# EAGLE design OwlPedal2 (EAGLE 9.6.2)
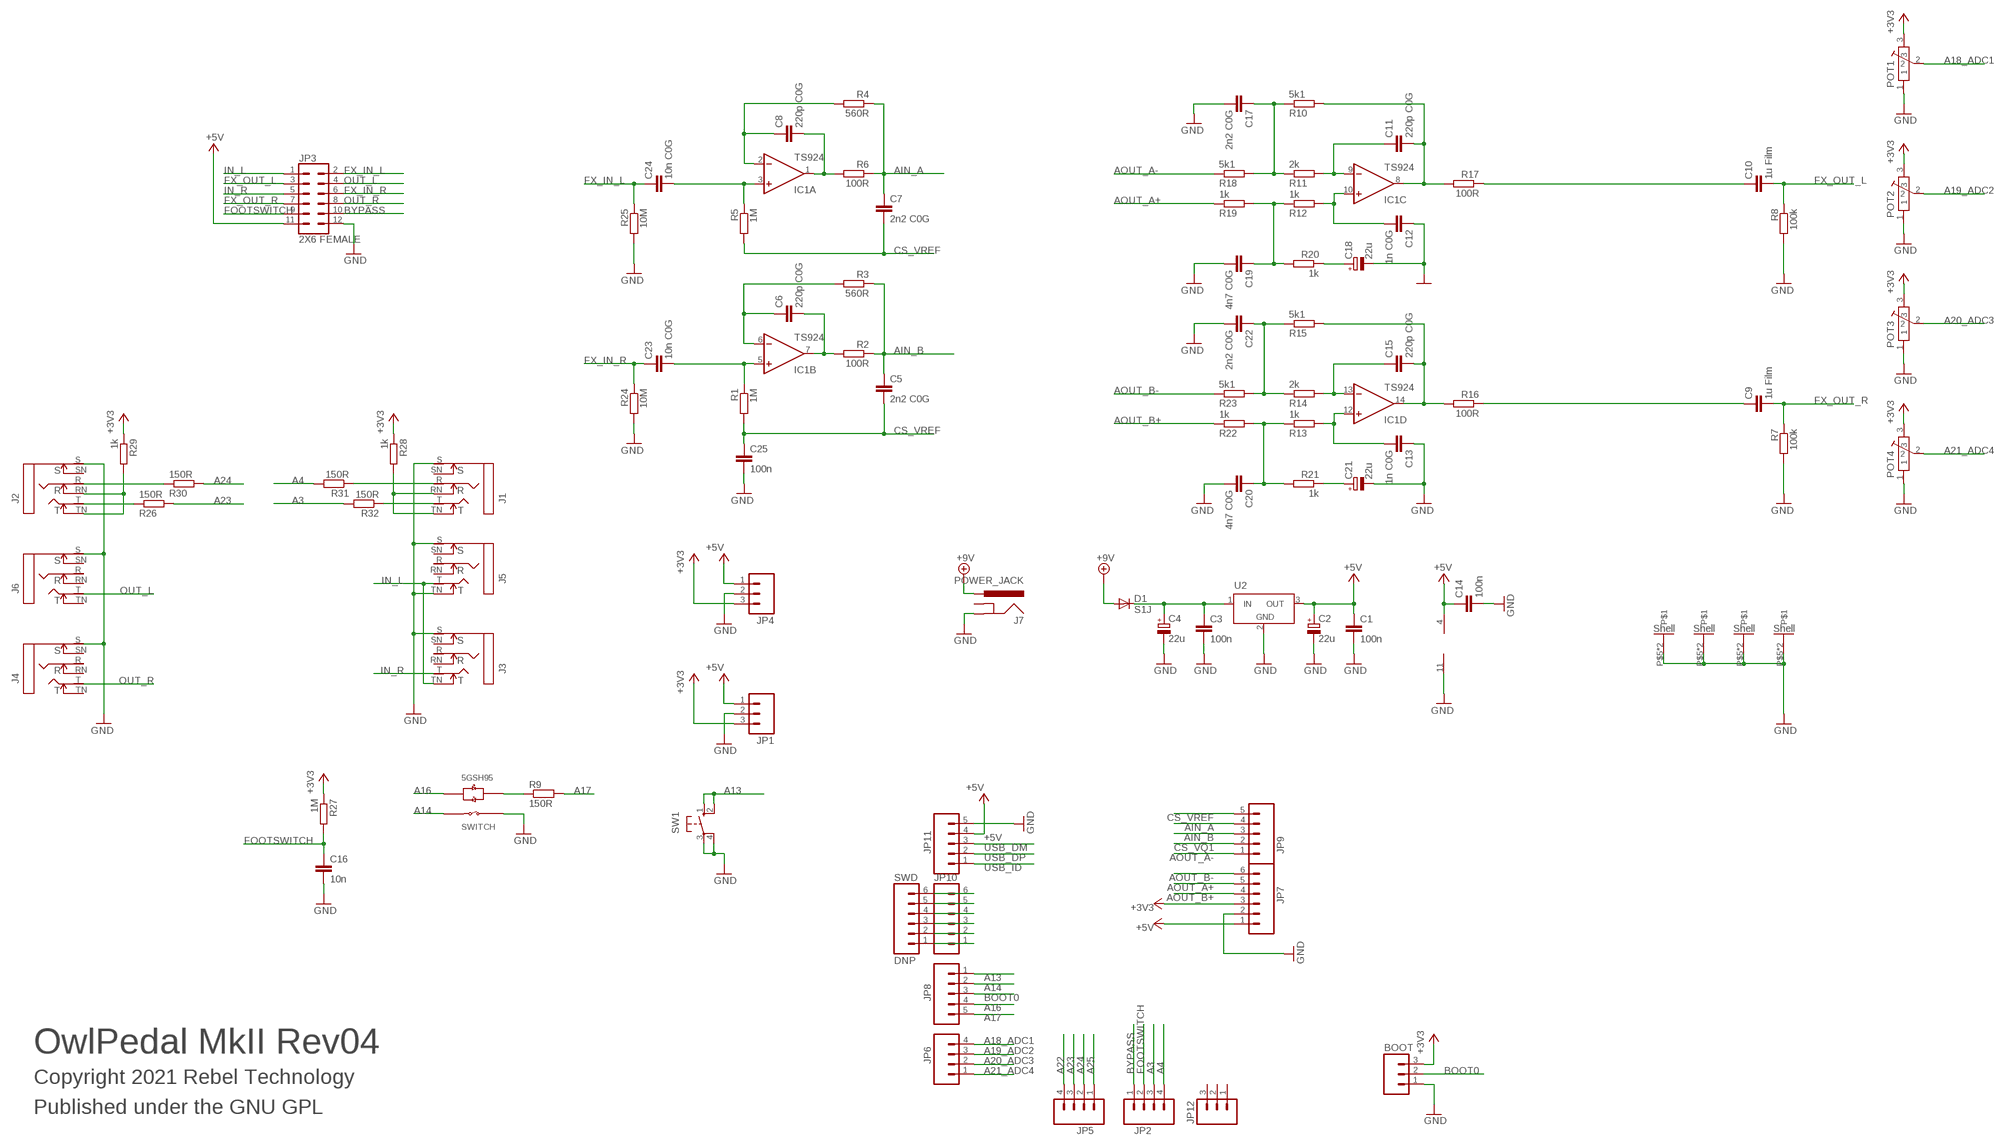
[diagram p0: schematic, sheet 1]

## Parts
BOOT  M03PTH  [1X03]
C1  100n  C-EUC0603  [C0603]
C2  22u  CPOL-EU153CLV-0505  [CPOL-5]
C3  100n  C-EUC0603  [C0603]
C4  22u  CPOL-EU153CLV-0505  [CPOL-5]
C5  2n2 C0G  C-EUC0603  [C0603]
C6  220p C0G  C-EUC0603  [C0603]
C7  2n2 C0G  C-EUC0603  [C0603]
C8  220p C0G  C-EUC0603  [C0603]
C9  1u Film  C-EUC1210  [C1210]
C10  1u Film  C-EUC1210  [C1210]
C11  220p C0G  C-EUC0603  [C0603]
C12  1n C0G  C-EUC0603  [C0603]
C13  1n C0G  C-EUC0603  [C0603]
C14  100n  C-EUC0603  [C0603]
C15  220p C0G  C-EUC0603  [C0603]
C16  10n  C-EUC0603  [C0603]
C17  2n2 C0G  C-EUC0603  [C0603]
C18  22u  CPOL-EU153CLV-0505  [CPOL-5]
C19  4n7 C0G  C-EUC0603  [C0603]
C20  4n7 C0G  C-EUC0603  [C0603]
C21  22u  CPOL-EU153CLV-0505  [CPOL-5]
C22  2n2 C0G  C-EUC0603  [C0603]
C23  10n C0G  C-EUC0603  [C0603]
C24  10n C0G  C-EUC0603  [C0603]
C25  100n  C-EUC0603  [C0603]
D1  S1J  DIODESMA  [SMA-DIODE]
IC1  TS924  LM324D  [SO14]
J1  NEUTRIK_NMJ6HCD2  [NMJ6HCD2]
J2  NEUTRIK_NMJ6HCD2  [NMJ6HCD2]
J3  NEUTRIK_NMJ6HCD2  [NMJ6HCD2]
J4  NEUTRIK_NMJ6HCD2  [NMJ6HCD2]
J5  NEUTRIK_NMJ6HCD2  [NMJ6HCD2]
J6  NEUTRIK_NMJ6HCD2  [NMJ6HCD2]
J7  POWER_JACK  [DC_JACK_SLOT]
JP1  M03PTH  [1X03]
JP2  M04PTH  [1X04]
JP3  2X6 FEMALE  CONN_06X2PTH_FEMALE  [2X6]
JP4  M03PTH  [1X03]
JP5  M04PTH  [1X04]
JP6  M04PTH  [1X04]
JP7  M06SIP  [1X06]
JP8  M05PTH  [1X05]
JP9  M05PTH  [1X05]
JP10  M06SIP  [1X06]
JP11  M05PTH  [1X05]
JP12  M03PTH  [1X03]
POT1  POT-ALPS-RK09L1140  [POT-ALPS-RK09L1140]
POT2  POT-ALPS-RK09L1140  [POT-ALPS-RK09L1140]
POT3  POT-ALPS-RK09L1140  [POT-ALPS-RK09L1140]
POT4  POT-ALPS-RK09L1140  [POT-ALPS-RK09L1140]
R1  1M  R-EU_0603  [0603]
R2  100R  R-EU_0603  [0603]
R3  560R  R-EU_0603  [0603]
R4  560R  R-EU_0603  [0603]
R5  1M  R-EU_0603  [0603]
R6  100R  R-EU_0603  [0603]
R7  100k  R-EU_0603  [0603]
R8  100k  R-EU_0603  [0603]
R9  150R  R-EU_0603  [0603]
R10  5k1  R-EU_0603  [0603]
R11  2k  R-EU_0603  [0603]
R12  1k  R-EU_0603  [0603]
R13  1k  R-EU_0603  [0603]
R14  2k  R-EU_0603  [0603]
R15  5k1  R-EU_0603  [0603]
R16  100R  R-EU_0603  [0603]
R17  100R  R-EU_0603  [0603]
R18  5k1  R-EU_0603  [0603]
R19  1k  R-EU_0603  [0603]
R20  1k  R-EU_0603  [0603]
R21  1k  R-EU_0603  [0603]
R22  1k  R-EU_0603  [0603]
R23  5k1  R-EU_0603  [0603]
R24  10M  R-EU_0603  [0603]
R25  10M  R-EU_0603  [0603]
R26  150R  R-EU_0603  [0603]
R27  1M  R-EU_0603  [0603]
R28  1k  R-EU_0603  [0603]
R29  1k  R-EU_0603  [0603]
R30  150R  R-EU_0603  [0603]
R31  150R  R-EU_0603  [0603]
R32  150R  R-EU_0603  [0603]
SW1  10-XX  [B3F-10XX]
SW2  5GTH9  [5GTH9]
SWD  DNP  M06SIP  [1X06]
U2  TSR-1-2450  [TSR-1-2450]

## Nets
+3V3: BOOT.3 JP1.3 JP4.3 JP7.3 POT1.3 POT2.3 POT3.3 POT4.3 R27.1 R28.1 R29.1
+5V: C1.1 C2.+ C14.1 IC1.4(P:V+) JP1.1 JP3.11 JP4.1 JP7.1 JP11.4 U2.3(OUT)
+9V: D1.A J7.PWR
A3: JP2.3 R32.2
A4: JP2.4 R31.2
A13: JP8.1 SW1.1(S) SW1.2(S1)
A14: JP8.2 SW2.4(SWITCH_A)
A16: JP8.4 SW2.-2(LED_G+)
A17: JP8.5 R9.2
A18_ADC1: JP6.4 POT1.2
A19_ADC2: JP6.3 POT2.2
A20_ADC3: JP6.2 POT3.2
A21_ADC4: JP6.1 POT4.2
A22: JP5.4
A23: JP5.3 R26.2
A24: JP5.2 R30.2
A25: JP5.1
AIN_A: C7.1 JP9.4 R4.1 R6.1
AIN_B: C5.1 JP9.3 R2.1 R3.1
AOUT_A+: JP7.5 R19.1
AOUT_A-: JP9.1 R18.1
AOUT_B+: JP7.4 R22.1
AOUT_B-: JP7.6 R23.1
BOOT0: BOOT.2 JP8.3
BYPASS: JP2.1 JP3.10
CS_VQ1: JP9.2
CS_VREF: C5.2 C7.2 C25.1 JP9.5 R1.2 R5.2
DC_IN_L: C24.1 IC1.3(A:+IN) R5.1
DC_IN_R: C23.1 IC1.5(B:+IN) R1.1
FOOTSWITCH: C16.1 JP2.2 JP3.9 R27.2
FX_IN_L: C24.2 JP3.2 R25.1
FX_IN_R: C23.2 JP3.6 R24.1
FX_OUT_L: C10.2 JP3.3 R8.1
FX_OUT_R: C9.2 JP3.7 R7.1
GND: BOOT.1 C1.2 C2.- C3.2 C4.- C12.1 C13.1 C14.2 C16.2 C17.2 C18.- C19.2 C20.2 C21.- C22.2 C25.2 IC1.11(P:V-) J1.S J2.S J3.S J4.S J5.S J5.TN J6.S J7.GND JP1.2 JP3.12 JP4.2 JP7.2 JP11.5 POT1.1 POT1.P$5 POT1.P$6 POT2.1 POT2.P$5 POT2.P$6 POT3.1 POT3.P$5 POT3.P$6 POT4.1 POT4.P$5 POT4.P$6 R7.2 R8.2 R24.2 R25.2 SW1.3(P) SW1.4(P1) SW2.1(SWITCH_B) U2.2(GND)
IN_L: J3.TN J5.T JP3.1
IN_R: J3.T JP3.5
N$1: J1.RN J1.TN R28.2
N$2: J2.R R30.1
N$3: JP10.1 SWD.1
N$4: J2.RN J2.TN R29.2
N$5: JP10.2 SWD.2
N$6: JP10.3 SWD.3
N$7: JP10.4 SWD.4
N$8: JP10.5 SWD.5
N$9: JP10.6 SWD.6
N$10: R9.1 SW2.+3(LED_R+)
N$12: J1.R R31.1
N$13: C17.1 R10.1 R11.1 R18.2
N$14: C6.1 IC1.6(B:-IN) R3.2
N$15: J1.T R32.1
N$16: C11.1 IC1.9(C:-IN) R11.2
N$17: C12.2 IC1.10(C:+IN) R12.2
N$18: C19.1 R12.1 R19.2 R20.2
N$19: C15.1 IC1.13(D:-IN) R14.2
N$20: C13.2 IC1.12(D:+IN) R13.2
N$21: C20.1 R13.1 R21.2 R22.2
N$22: C8.1 IC1.2(A:-IN) R4.2
N$23: C8.2 IC1.1(A:OUT) R6.2
N$24: C22.1 R14.1 R15.1 R23.2
N$25: C6.2 IC1.7(B:OUT) R2.2
N$26: J2.T R26.1
N$28: C11.2 IC1.8(C:OUT) R10.2 R17.2
N$29: C18.+ R20.1
N$30: C9.1 R16.1
N$31: C21.+ R21.1
N$32: C15.2 IC1.14(D:OUT) R15.2 R16.2
N$35: C10.1 R17.1
N$51: C3.1 C4.+ D1.C U2.1(IN)
OUT_L: J6.T JP3.4
OUT_R: J4.T JP3.8
USB_DM: JP11.3
USB_DP: JP11.2
USB_ID: JP11.1
Unconnected: J1.SN J2.SN J3.R J3.RN J3.SN J4.R J4.RN J4.SN J4.TN J5.R J5.RN J5.SN J6.R J6.RN J6.SN J6.TN J7.GNDBREAK JP12.1 JP12.2 JP12.3

## Notes on the sheet
- OwlPedal MkII Rev04
- Copyright 2021 Rebel Technology
- Published under the GNU GPL

## Library data of the parts
BOOT JP1 JP4 JP12 = SparkFun:M03: Header 3 Standard 3-pin 0.1" header. Use with straight break away headers (SKU : PRT-00116), right angle break away headers (PRT-00553), swiss pins (PRT-00743), machine pins (PRT-00117), and female headers (PRT-00115). Molex polarized connector foot print use with SKU : PRT-08232 with associated crimp pins and housings.
C1 C3 C9 C10 C16 C23-C25 = Rebel:C-EU: CAPACITOR, European symbol
C2 C4 C18 C21 = Rebel:CPOL-EU: POLARIZED CAPACITOR, European symbol
C5-C8 C11-C15 C17 C19 C20 C22 = resistor:C-EU: CAPACITOR, European symbol
D1 = SparkFun:DIODE: Diode These are standard reverse protection diodes and small signal diodes. SMA package can handle up to about 1A. SOD-323 can handle about 200mA. What the SOD-323 package when ordering, there are some mfgs out there that are 5-pin packages.
IC1 = linear:LM324: OP AMP
J1-J6 = neutrik_jacks:NEUTRIK_NMJ6HCD2
J7 = Rebel:POWER_JACK: Power Jack This is the standard 5.5mm barrel jack for power. The PTH is the most common, proven, reliable, footprint. All others are experimental. The Slot footprint only works if the mill layer is transmitted to the PCB fab house so be warned. Spark Fun Electronics SKU : PRT-00119. Mating wall wart : TOL-00298 (and others)
JP2 JP5 JP6 = SparkFun:M04: Header 4 Standard 4-pin 0.1" header. Use with straight break away headers (SKU : PRT-00116), right angle break away headers (PRT-00553), swiss pins (PRT-00743), machine pins (PRT-00117), and female headers (PRT-00115). Molex polarized connector foot print use with SKU : PRT-08231 with associated crimp pins and housings. 1MM SMD Version SKU: PRT-10208
JP3 = SparkFun-Connectors:CONN_06X2: Multi connection point. Often used as Generic Header-pin footprint for 0.1 inch spaced/style header connections On any of the 0.1 inch spaced packages, you can populate with these: Break Away Headers - Straight <https://www.sparkfun.com/products/116> (PRT-00116) Break Away Male Headers - Right Angle <https://www.sparkfun.com/products/553> (PRT-00553) Female Headers <https://www.sparkfun.com/products/115> (PRT-00115) Break Away Headers - Machine Pin <https://www.sparkfun.com/products/117> (PRT-00117) Break Away Female Headers - Swiss Machine Pin <https://www.sparkfun.com/products/743> (PRT-00743); PROD_ID: CONN-12423
JP7 JP10 SWD = SparkFun:M06: Header 6 Standard 6-pin 0.1" header. Use with straight break away headers (SKU : PRT-00116), right angle break away headers (PRT-00553), swiss pins (PRT-00743), machine pins (PRT-00117), and female headers (PRT-00115). Molex polarized connector foot print use with SKU : PRT-08094 with associated crimp pins and housings. NOTES ON THE VARIANTS LOCK and LOCK_LONGPADS... This footprint was designed to help hold the alignment of a through-hole component (i.e. 6-pin header) while soldering it into place. You may notice that each hole has been shifted either up or down by 0.005 of an inch from it's more standard position (which is a perfectly straight line). This slight alteration caused the pins (the squares in the middle) to touch the edges of the holes. Because they are alternating, it causes a "brace" to hold the component in place. 0.005 has proven to be the perfect amount of "off-center" position when using our standard breakaway headers. Although looks a little odd when you look at the bare footprint, once you have a header in there, the alteration is very hard to notice. Also, if you push a header all the way into place, it is covered up entirely on the bottom side. This idea of altering the position of holes to aid alignment will be further integrated into the Sparkfun Library for other footprints. It can help hold any component with 3 or more connection pins.
JP8 JP9 JP11 = SparkFun:M05: Header 5 Standard 5-pin 0.1" header. Use with straight break away headers (SKU : PRT-00116), right angle break away headers (PRT-00553), swiss pins (PRT-00743), machine pins (PRT-00117), and female headers (PRT-00115). Molex polarized connector foot print use with SKU : PRT-08230 with associated crimp pins and housings.
POT1-POT4 = Rebel:POT-ALPS-RK09L
R1-R32 = Rebel:R-EU_: RESISTOR, European symbol
SW1 = switch-omron:10-XX: OMRON SWITCH; MPN: B3F-1000; OC_FARNELL: 176432; OC_NEWARK: 36M3542
SW2 = SWITCH-5GTH9:5GTH9
U2 = Hangar:TSR-1-2450

## Board
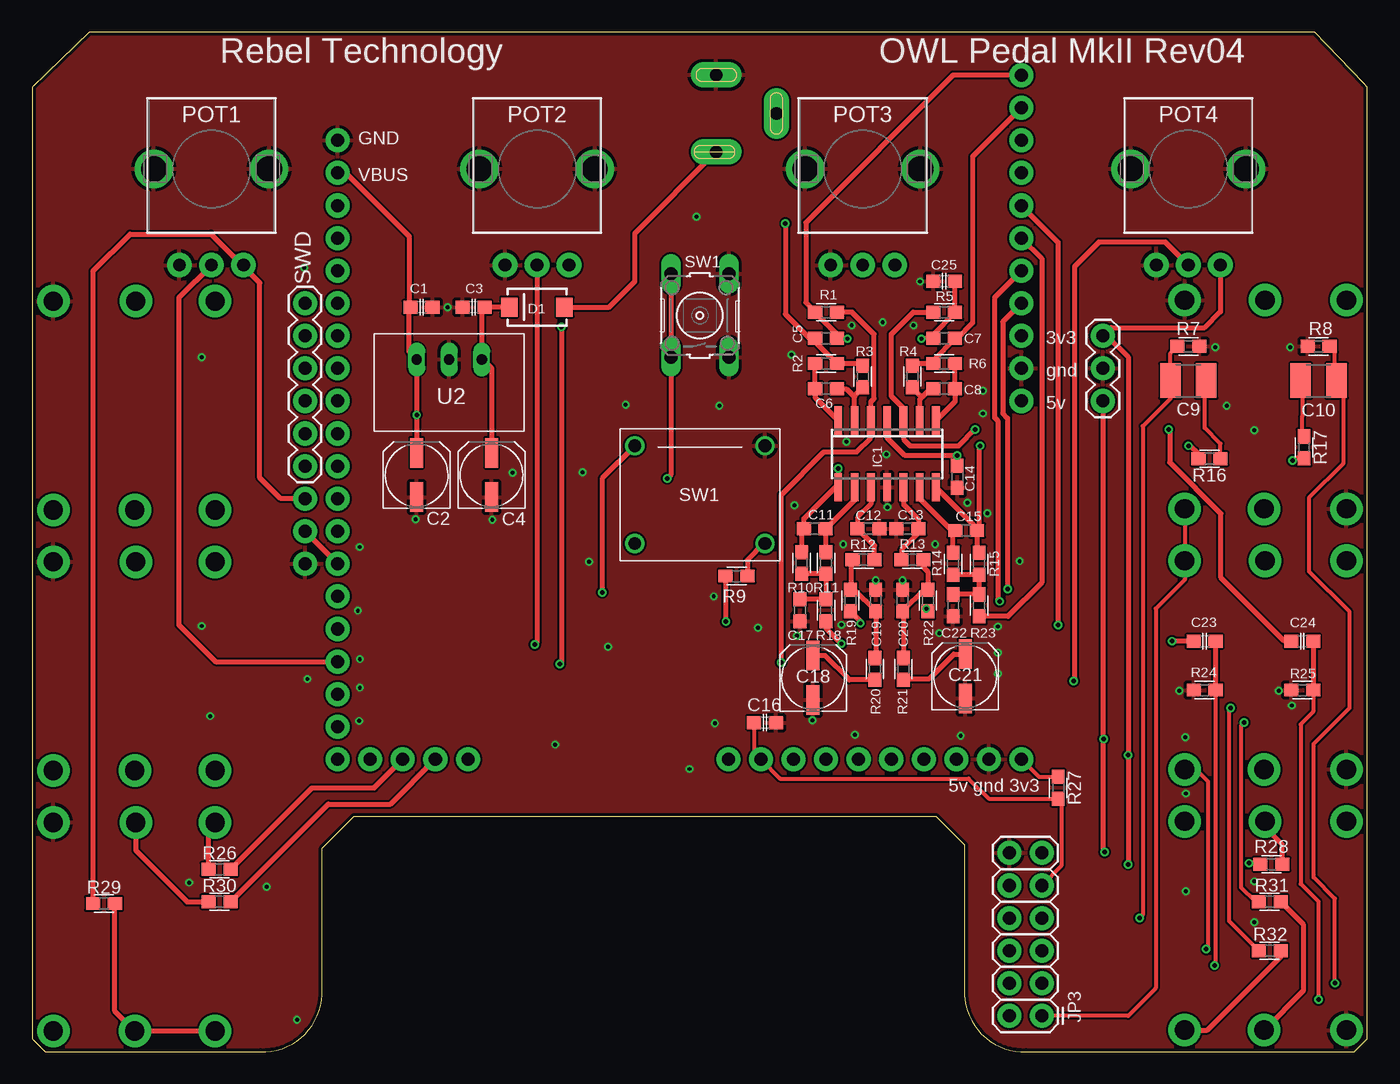
[diagram p1: board, top side]
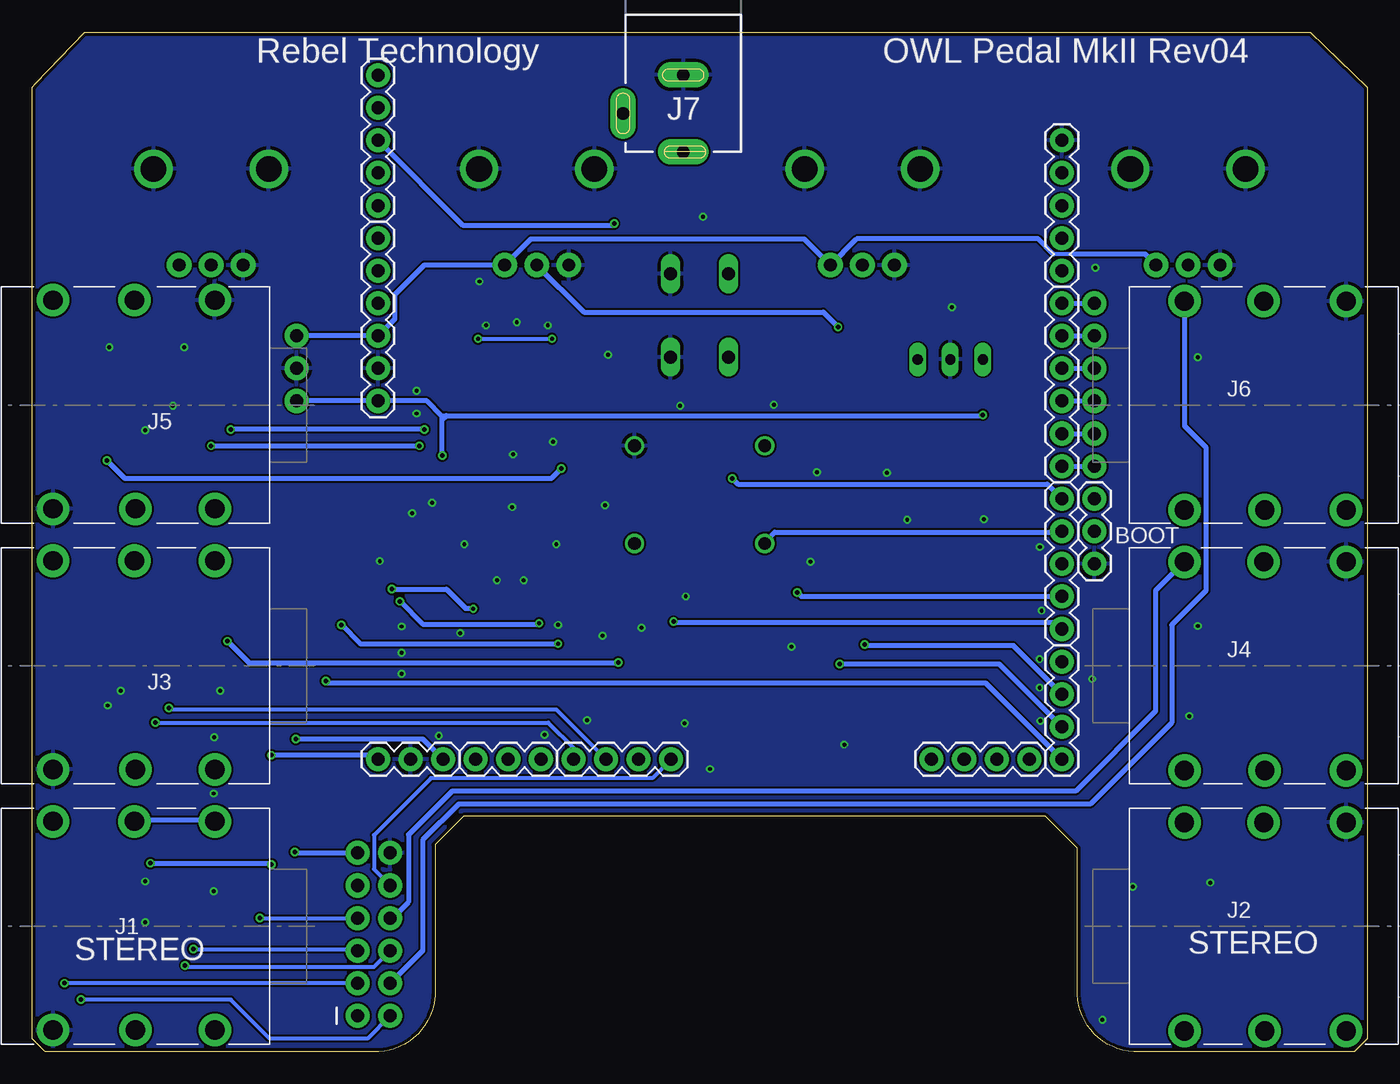
[diagram p2: board, bottom side, seen from below]

Size 104.17 x 79.5 mm. Coordinates in mm from the lower left corner, seen from the top.
Outline: 22.63,4.45 arc-90 17.81,0 1.04,0 0.03,1.02 0.03,75.18 0,75.18 4.45,79.5 100.06,79.5 103.87,75.5 104.17,75.18 104.17,1.02 103.15,0 77.56,0 arc-90 72.73,4.45 72.73,16.13 70.51,18.35 25.11,18.35 22.63,15.87 22.63,4.45
Outline: 22.63,4.41 22.63,4.45
Copper layers (1*16): Top 0.035mm / dielectric 1.5mm / Bottom 0.035mm
Design rules "SeeedStudio_2layer_DRU_no_angle_20140221": minimum track width 6mil, minimum drill 12mil, track to track 6mil, track to pad 6mil, pad to pad 6mil, via to via 6mil, smd to smd 0mil, copper to edge 10mil, drill to drill 10mil, minimum pad ring 10mil, minimum via ring 6mil, stop-mask expansion 2mil, vias tented up to drill 100mil, thermal gap 10mil

### Footprints (pad centres in the part's own frame; a part is rotated, then mirrored left to right if it is on the bottom)
1X03 = drill 1.016 pad 1.88: 1 0,0; 2 2.54,0; 3 5.08,0
C0603 = smd 1.1 x 1: 1 -0.85,0; 2 0.85,0
CPOL-5 = smd 2.3 x 1: + 1.725,0; - -1.725,0
C1210 = smd 1.6 x 2.7: 1 -1.4,0; 2 1.4,0
SMA-DIODE = smd 1.27 x 1.47: A -2.15,0; C 2.15,0
SO14 = smd 0.6 x 2.2: 1 -3.81,-2.6; 2 -2.54,-2.6; 3 -1.27,-2.6; 4 0,-2.6; 5 1.27,-2.6; 6 2.54,-2.6; 7 3.81,-2.6; 8 3.81,2.6; 9 2.54,2.6; 10 1.27,2.6; 11 0,2.6; 12 -1.27,2.6; 13 -2.54,2.6; 14 -3.81,2.6
NMJ6HCD2 = drill 1.5 pad 2.54: R -0.318,8.096; RN -0.238,-8.176; S 6.112,8.096; SN 6.112,-8.176; T -6.509,8.096; TN -6.509,-8.176
DC_JACK_SLOT = drill 1 pad 2 long: GND 0,4.743; GNDBREAK 4.697,7.742; PWR 0,10.749
1X04 = drill 1.016 pad 1.88: 1 0,0; 2 2.54,0; 3 5.08,0; 4 7.62,0
2X6 = drill 1.016 pad 1.88: 1 0,0; 2 0,2.54; 3 2.54,0; 4 2.54,2.54; 5 5.08,0; 6 5.08,2.54; 7 7.62,0; 8 7.62,2.54; 9 10.16,0; 10 10.16,2.54; 11 12.7,0; 12 12.7,2.54
1X06 = drill 1.016 pad 1.88: 1 0,0; 2 2.54,0; 3 5.08,0; 4 7.62,0; 5 10.16,0; 6 12.7,0
1X05 = drill 1.016 pad 1.88: 1 0,0; 2 2.54,0; 3 5.08,0; 4 7.62,0; 5 10.16,0
POT-ALPS-RK09L1140 = drill 1 pad 1.93: 1 -2.5,-7.5; 2 0,-7.5; 3 2.5,-7.5 | drill 2: P$5 -4.5,0; P$6 4.5,0
0603 = smd 1.1 x 1: 1 -0.85,0; 2 0.85,0
B3F-10XX = drill 1.016 long: 1 -3.251,2.261; 2 3.251,2.261; 3 -3.251,-2.261; 4 3.251,-2.261
5GTH9 = drill 1: 1 5.08,3.81; 4 -5.08,-3.81; +3 5.08,-3.81; -2 -5.08,3.81
TSR-1-2450 = drill 0.8 long: 1 -2.54,0; 2 0,0; 3 2.54,0

### Placement (x,y rotation side)
BOOT  21.3,38.04 90 bottom
C1  30.38,58.04 0 top
C2  30,44.96 90 top
C3  34.44,58.04 180 top
C4  35.84,44.96 90 top
C5  61.94,55.63 0 top
C6  61.94,51.69 180 top
C7  71.15,55.63 180 top
C8  71.15,51.69 0 top
C9  90.2,52.32 180 top
C10  100.36,52.32 0 top
C11  61.05,40.77 180 top
C12  65.24,40.77 180 top
C13  68.29,40.77 0 top
C14  72.16,44.83 270 top
C15  72.86,40.64 0 top
C16  57.18,25.65 0 top
C17  59.91,34.42 270 top
C18  60.92,29.15 90 top
C19  65.81,35.18 90 top
C20  67.91,35.18 90 top
C21  72.8,29.27 90 top
C22  71.84,34.8 270 top
C23  91.47,32 0 top
C24  99.09,32 0 top
C25  71.15,60.07 180 top
D1  39.38,58.05 180 top
IC1  66.7,46.61 180 top
J1  96.42,9.78 180 bottom
J2  7.77,9.78 0 bottom
J3  96.42,30.1 180 bottom
J4  7.77,30.1 0 bottom
J5  96.42,50.42 180 bottom
J6  7.77,50.42 0 bottom
J7  53.37,80.9 180 bottom
JP1  83.53,50.74 90 top
JP2  54.32,22.8 180 bottom
JP3  78.77,2.79 90 top
JP4  72.1,22.8 180 bottom
JP5  34,22.8 0 bottom
JP6  23.84,22.8 90 bottom
JP7  77.18,50.74 90 bottom
JP8  23.84,43.12 270 bottom
JP9  77.18,65.98 90 bottom
JP10  23.84,58.36 270 bottom
JP11  23.84,60.9 90 bottom
JP12  64.48,22.8 180 bottom
POT1  14,68.83 0 top
POT2  39.4,68.83 0 top
POT3  64.8,68.83 0 top
POT4  90.2,68.83 0 top
R1  61.94,57.66 180 top
R2  61.94,53.66 180 top
R3  64.8,52.64 270 top
R4  68.67,52.64 270 top
R5  71.15,57.66 0 top
R6  71.15,53.66 0 top
R7  90.2,54.99 0 top
R8  100.36,54.99 180 top
R9  54.95,37.08 180 top
R10  60.03,38.1 90 top
R11  61.94,38.1 90 top
R12  64.86,38.35 0 top
R13  68.67,38.35 180 top
R14  71.84,38.04 90 top
R15  73.88,38.04 90 top
R16  91.85,46.23 180 top
R17  99.21,47.12 270 top
R18  61.94,34.42 90 top
R19  63.84,35.18 90 top
R20  65.75,29.84 90 top
R21  67.97,29.84 90 top
R22  69.88,35.18 90 top
R23  73.88,34.8 90 top
R24  91.47,28.19 180 top
R25  99.09,28.19 180 top
R26  14.63,14.22 0 top
R27  80.04,20.57 270 top
R28  96.67,14.61 0 top
R29  5.61,11.56 0 top
R30  14.63,11.68 0 top
R31  96.55,11.68 180 top
R32  96.55,7.87 180 top
SW1  52.1,57.4 90 top
SW2  52.1,43.43 0 top
SWD  21.3,58.36 270 top
U2  32.54,53.98 180 top

### Tracks (layer width: path | path; a pad name or v marks a point on that pad's centre or on a via)
+3V3  (via drill 0.35)
  Top 0.305: JP4.3 78.55,21.42 R27.1
  Top 0.406: POT4.3 92.7,57.68 91.47,56.45 84.16,56.45 JP1.3 83.85,55.82 85.5,54.16 v85.5,23.11 v85.5,14.61 | BOOT.3 19.39,43.12 17.77,44.74 17.77,59.94 16.5,61.21 | 16.5,61.21 POT1.3 | v94.93,14.69 95.73,14.69 R28.1 | R29.1 4.76,60.87 7.65,63.75 13.96,63.75 16.5,61.21
  Bottom 0.305: 22.89,62.19 24.5,62.19
  Bottom 0.406: JP1.3 JP7.3 75.88,57.11 75.88,59.02 73.57,61.33 POT3.3 65.26,63.37 43.93,63.37 POT2.3 39.86,63.37 25.68,63.37 24.5,62.19 | POT1.3 16.5,61.35 17.34,62.19 22.89,62.19 | v94.93,14.69 85.58,14.69 v85.5,14.61 | v85.5,23.11 77.5,23.11 JP4.3
+5V  (via drill 0.35)
  Top 0.406: IC1.4 66.7,47.88 68.1,46.48 v72.16,46.48 C14.1 | 29.43,57.94 C1.1 | JP1.1 83.53,24.45 | 83.53,24.45 v83.59,24.38 | 83.53,24.45 83.53,15.56 83.59,15.49 v83.65,15.56 | JP11.4 24.47,68.52 29.43,63.56 29.43,57.94 | 29.43,57.94 29.43,54.55 U2.3 v30,49.66 C2.+
  Bottom 0.406: JP1.1 JP7.1 73.37,50.74 72.23,49.6 71.84,49.6 | JP4.1 73.69,24.38 v83.59,24.38 | v83.65,15.56 83.59,15.49 JP3.11 | v30,49.66 30.06,49.6 71.84,49.6 | v72.16,46.48 72.16,49.28 | 72.16,49.28 72.16,49.47 | 72.16,49.28 71.84,49.6
+9V
  Top 0.406: J7.PWR 47.02,63.8 47.02,60.06 45.01,58.05 D1.A
A3  (via drill 0.35)
  Top 0.305: v93.5,26.79 93.37,26.67 93.37,10.2 R32.2
  Bottom 0.305: JP2.3 63.27,26.67 93.37,26.67 v93.5,26.79
A4  (via drill 0.35)
  Top 0.305: v94.55,25.65 94.3,25.4 94.3,12.82 95.44,11.68 R31.2
  Bottom 0.305: JP2.4 61.94,23.69 63.91,25.65 v94.55,25.65
A13  (via drill 0.35)
  Top 0.406: SW1.2 SW1.1 49.83,44.98 v49.56,44.7
  Bottom 0.406: v49.56,44.7 49.11,44.26 24.98,44.26 JP8.1
A14
  Bottom 0.406: JP8.2 23.9,40.51 46.25,40.51 47.02,39.75 SW2.4
A16  (via drill 0.35)
  Top 0.406: SW2.-2 44.48,44.7 v44.48,35.81
  Bottom 0.406: v44.48,35.81 44.16,35.5 JP8.4
A17  (via drill 0.35)
  Top 0.406: v54.13,33.53 54.13,37.06 R9.2
  Bottom 0.406: JP8.5 24.38,33.49 54.09,33.49 v54.13,33.53
A18_ADC1
  Top 0.406: POT1.2 11.46,58.79 11.46,33.27 14.31,30.42 JP6.4
A19_ADC2  (via drill 0.35)
  Top 0.406: POT2.2 39.4,31.94 v39.21,31.75
  Bottom 0.406: JP6.3 27.65,31.69 39.14,31.69 v39.21,31.75
A20_ADC3  (via drill 0.35)
  Top 0.406: v41.17,30.23 41.3,30.35 v41.3,56.52
  Bottom 0.406: JP6.2 28.73,30.23 v41.17,30.23 | v41.3,56.52 42.44,57.66 61.12,57.66 POT3.2
A21_ADC4  (via drill 0.35)
  Top 0.406: POT4.2 88.41,63.12 83.21,63.12 81.31,61.21 81.31,28.96 v81.24,28.89
  Bottom 0.406: JP6.1 29.79,28.75 81.1,28.75 v81.24,28.89
A23
  Top 0.406: R26.2 21.83,20.57 26.7,20.57 JP5.3
A24
  Top 0.406: R30.2 23.1,19.3 27.97,19.3 JP5.2
AIN_A
  Top 0.305: R4.1 68.84,53.66 | R6.1 70.3,53.93 | 72.16,55.63 C7.1
  Top 0.406: R6.1 68.84,53.66 | C7.1 70.3,53.93 | JP9.4 73.37,69.79 73.37,56.83 72.16,55.63
AIN_B  (via drill 0.35)
  Top 0.305: R3.1 64.63,53.66 | 60.65,55.63 C5.1 61.09,55.36
  Top 0.406: 64.63,53.66 R2.1 61.09,55.36 | v58.76,64.58 58.76,57.51 60.65,55.63
  Bottom 0.406: JP9.3 70.57,64.45 58.89,64.45 v58.76,64.58
AOUT_A+  (via drill 0.3, 0.35)
  Top 0.406: R19.1 64.6,33.57 v64.6,33.4 | JP7.5 75.08,58.8 75.08,49.47 75.34,49.21 75.34,35.24 v75.46,35.12
  Bottom 0.406: v75.46,35.12 73.69,33.34 64.67,33.34 v64.6,33.4
AOUT_A-  (via drill 0.3, 0.35)
  Top 0.406: R18.1 61.94,33.02 v63.14,31.81 | JP9.1 80.04,63.12 v80.04,33.27
  Bottom 0.406: v63.14,31.81 78.57,31.81 v80.04,33.27
AOUT_B+  (via drill 0.3, 0.35)
  Top 0.305: R22.1 69.88,34.42 v69.75,34.54
  Top 0.406: JP7.4 75.72,56.9 75.72,49.78 76.1,49.4 v76.1,36.07
  Bottom 0.406: v76.1,36.07 71.84,36.07 70.32,34.54 v69.75,34.54
AOUT_B-
  Top 0.406: JP7.6 78.77,61.85 78.77,36.58 76.14,33.95 R23.1
BOOT0
  Top 0.406: JP8.3 BOOT.2
BYPASS
  Bottom 0.305: JP2.1 55.78,21.34 73.05,21.34 77.5,16.89 77.5,14.22 JP3.10
CS_VREF  (via drill 0.3)
  Top 0.305: 70.3,55.96 C7.2 69.4,55.63 v69.37,55.59 | v63.62,55.59 63.58,55.63
  Top 0.406: 70.3,55.96 R5.2 C25.1 | 63.58,55.63 C5.2 62.79,55.96 R1.2 60.35,58.4 60.35,64.64 71.84,76.14 JP9.5
  Bottom 0.305: v69.37,55.59 v63.62,55.59
DC_IN_L  (via drill 0.35)
  Top 0.406: R5.1 68.73,57.66 67.02,55.94 67.02,51.12 67.97,50.16 IC1.3 67.97,47.75 68.48,47.24 72.29,47.24 v73.56,48.51 | v88.67,48.51 88.75,48.44 88.75,45.95 92.74,41.96 92.74,36.95 97.69,32 C24.1
  Bottom 0.406: v73.56,48.51 v88.67,48.51
DC_IN_R  (via drill 0.35)
  Top 0.406: R1.1 63.97,57.66 65.68,55.94 65.68,50.93 65.43,50.67 IC1.5 65.43,47.88 64.31,46.76 61.77,46.76 58.45,43.43 v58.45,30.35 | C23.1 v88.93,32
  Bottom 0.406: v88.93,32 87.25,30.33 58.47,30.33 v58.45,30.35
FOOTSWITCH
  Top 0.305: JP3.9 80.29,14.48 80.29,19.47 R27.2 74.62,19.72 73.05,21.3 58.36,21.3 JP2.2 56.33,23.33 C16.1
FX_IN_L  (via drill 0.35)
  Top 0.305: v100.36,4.06 100.36,11.68 98.96,13.08 98.96,25.53 99.94,26.5 R25.1 100.02,28.28
  Top 0.406: C24.2 99.94,28.36 100.02,28.28
  Bottom 0.305: JP3.2 78,1.02 85.62,1.02 88.67,4.06 v100.36,4.06
FX_IN_R  (via drill 0.35)
  Top 0.305: v92.23,6.73 92.35,6.86 92.35,28.16 R24.1 92.4,28.28
  Top 0.406: C23.2 92.32,28.36 92.4,28.28
  Bottom 0.305: v92.23,6.73 92.1,6.6 77.5,6.6 JP3.6
FX_OUT_L  (via drill 0.35)
  Top 0.305: R8.1 101.63,54.57 101.63,52.45 C10.2 102.26,51.82 102.26,45.85 99.59,43.18 99.59,37.47 102.77,34.29 102.77,26.8 99.97,24 99.97,13.59 101.63,11.94 v101.63,5.33
  Bottom 0.305: JP3.3 v101.63,5.33
FX_OUT_R  (via drill 0.35)
  Top 0.305: R7.1 88.8,54.44 C9.2 88.8,50.92 86.64,48.77 86.64,10.67 v86.39,10.41
  Bottom 0.305: v86.39,10.41 JP3.7
GND  (via drill 0.3)
  Top 0.305: v67.91,36.77 C20.2 | v65.81,36.77 C19.2
  other vias: 20.66,2.48 32.41,58.04 37.49,45.15 35.9,41.47 74.16,51.54 72.95,42.79 66.35,56.88 63.51,47.55 66.65,46.57 66.73,42.46 56.62,33.05 46.31,50.44 53.61,50.36 59.48,42.61 77.04,38.25 25.54,39.35 29.92,41.51 25.57,28.39 25.51,25.79 25.57,30.61 21.22,61.13 51.29,22.04 64.18,24.71 72.43,24.64 89.96,24.52 75.34,29.46 25.41,34.39 42.94,45.19 43.45,38.2 51.83,65.09 21.48,29.06 13.22,33.19 13.22,54.14 18.3,12.87 95.34,13.27 75.34,31.12 75.34,33.15 74.51,41.97 53.17,35.5 40.81,23.94 44.94,31.56 12.27,13.18 13.9,26.17 60.88,25.85 95.34,10.1 53.26,25.59 63.94,56.63 68.76,56.63 59.24,54.34 59.67,32.42 90.01,20.13 89.5,28.13 97.24,28.13 92.29,54.93 98.13,54.93 93.18,50.36 95.34,48.45 70.76,32.64 63.14,33.27 74.16,49.76 63.27,39.56 70.45,39.56 98.26,26.99 90.01,12.51 69.27,60.05
  pour Bottom: -5.05,-1.02 -5.05,82.17 110.2,82.17 110.2,-1.02
  pour Top: -6.32,-8.38 -6.32,80.9 108.93,80.9 108.93,-8.38
IN_L
  Top 0.305: J5.T J3.TN 89.91,36.8 87.66,34.54 87.66,4.95 85.5,2.79 JP3.1
IN_R  (via drill 0.35)
  Top 0.305: v91.59,8 91.72,8.13 91.72,21.08 90.67,22.13 90.04,22.13 J3.T
  Bottom 0.305: v91.59,8 78.89,8 JP3.5
N$1
  Top 0.406: R28.2 97.52,16.18 96.18,17.53 J1.RN
  Bottom 0.406: J1.RN 96.05,18.08 90.04,18.08 J1.TN
N$2
  Top 0.406: R30.1 12.09,11.68 8.09,15.69 J2.R
N$3
  Bottom 0.406: JP10.1 SWD.1
N$4
  Top 0.406: J2.TN J2.RN 6.46,3.15 R29.2
N$5
  Bottom 0.406: JP10.2 SWD.2
N$6
  Bottom 0.406: JP10.3 SWD.3
N$7
  Bottom 0.406: JP10.4 SWD.4
N$8
  Bottom 0.406: JP10.5 SWD.5
N$9
  Bottom 0.406: JP10.6 SWD.6
N$10
  Top 0.406: SW2.+3 57.07,39.62 55.8,38.35 R9.1
N$12
  Top 0.406: R31.1 99.15,9.93 99.15,4.73 J1.R
N$13
  Top 0.406: R10.1 R11.1 R18.2 C17.1
N$14
  Top 0.305: 64.16,51.05 64.16,51.16
  Top 0.406: IC1.6 64.16,51.05 63.53,51.69 C6.1 | 64.16,51.16 R3.2
N$15
  Top 0.406: R32.1 97.4,7.39 91.69,1.68 J1.T
N$16
  Top 0.305: R11.2 61.9,38.99
  Top 0.406: 61.9,38.99 C11.1 61.94,40.77 64.16,42.99 IC1.9
N$17
  Top 0.406: R12.2 65.71,39.45 C12.2 64.39,41.66 65.43,42.7 IC1.10
N$18
  Top 0.305: R12.1 63.88,38.23 | 63.88,36.07 R19.2 64.11,36.03
  Top 0.406: 63.88,38.23 63.88,36.07 | 64.11,36.03 C19.1 65.81,30.76 R20.2
N$19
  Top 0.406: IC1.13 69.24,43.12 71.72,40.64 C15.1 71.84,40.47 R14.2
N$20
  Top 0.406: R13.2 67.82,39.12 69.14,40.44 C13.2 69.14,41.53 67.97,42.7 IC1.12
N$21
  Top 0.406: R21.2 67.97,34.27 C20.1 69.61,36.03 R22.2 69.88,37.43 69.52,37.78 R13.1
N$22
  Top 0.305: C8.1 70.09,51.69
  Top 0.406: IC1.2 69.24,50.84 69.43,51.03 | 69.43,51.03 R4.2 | 70.09,51.69 69.43,51.03
N$23
  Top 0.406: IC1.1 72,50.69 C8.2 R6.2
N$24
  Top 0.406: R14.1 R15.1 R23.2 C22.1
N$25
  Top 0.406: IC1.7 61.09,51.01 C6.2 R2.2
N$26
  Top 0.406: R26.1 13.78,17.37 J2.T
N$28  (via drill 0.35)
  Top 0.305: 62.77,44.13 62.83,44.07 IC1.8
  Top 0.406: R10.2 60.03,40.6 C11.2 60.2,41.57 62.77,44.13 | R17.2 98.49,46.27 v98.32,46.1 | v62.89,45.47 62.89,44.13 62.83,44.07
  Bottom 0.406: v98.32,46.1 96.93,44.7 63.65,44.7 v62.89,45.47
N$29
  Top 0.406: C18.+ 61.86,30.87 63.74,28.99 R20.1
N$30
  Top 0.305: C9.1 91.6,51.18 91.47,51.05 91.47,48.64 92.7,47.41 R16.1
N$31
  Top 0.406: C21.+ 71.91,31 69.99,29.08 68.06,29.08 R21.1
N$32  (via drill 0.35)
  Top 0.305: C15.2 73.69,40.64
  Top 0.406: R16.2 91,46.57 90.32,47.24 v90.2,47.24 | IC1.14 73.66,40.86 | 73.66,40.86 73.69,40.83 73.69,40.64 | v73.94,47.24 73.89,47.24 73.85,47.2 73.85,41.06 73.66,40.86 | C15.2 73.71,39.05 R15.2
  Bottom 0.406: v90.2,47.24 v73.94,47.24
N$35
  Top 0.305: C10.1 99.09,52.19 99.09,49.78 99.09,49.58 99.09,48.09 R17.1
N$51
  Top 0.406: C4.+ 35.84,53.34 35.2,53.98 U2.1 35.08,57.82 C3.1 35.31,58.05 D1.C
OUT_L
  Bottom 0.406: J6.T 14.28,48.8 12.6,47.12 12.6,35.94 15.27,33.27 15.27,25.65 21.62,19.3 70.89,19.3 73.69,16.51 73.69,7.87 JP3.4
OUT_R
  Bottom 0.406: J4.T 16.54,35.94 16.54,26.54 22.76,20.32 71.4,20.32 74.8,16.92 74.8,11.65 76.04,10.41 JP3.8

### Text on the board
tPlace: Rebel Technology | OWL Pedal MkII Rev04 | GND | VBUS | 3v3 | gnd | 5v | 5v | gnd | 3v3
bPlace: OWL Pedal MkII Rev04 | Rebel Technology | BOOT | STEREO | STEREO
tNames: SW1